# EasyEDA Pro project XORBell.eprj

# Board Main
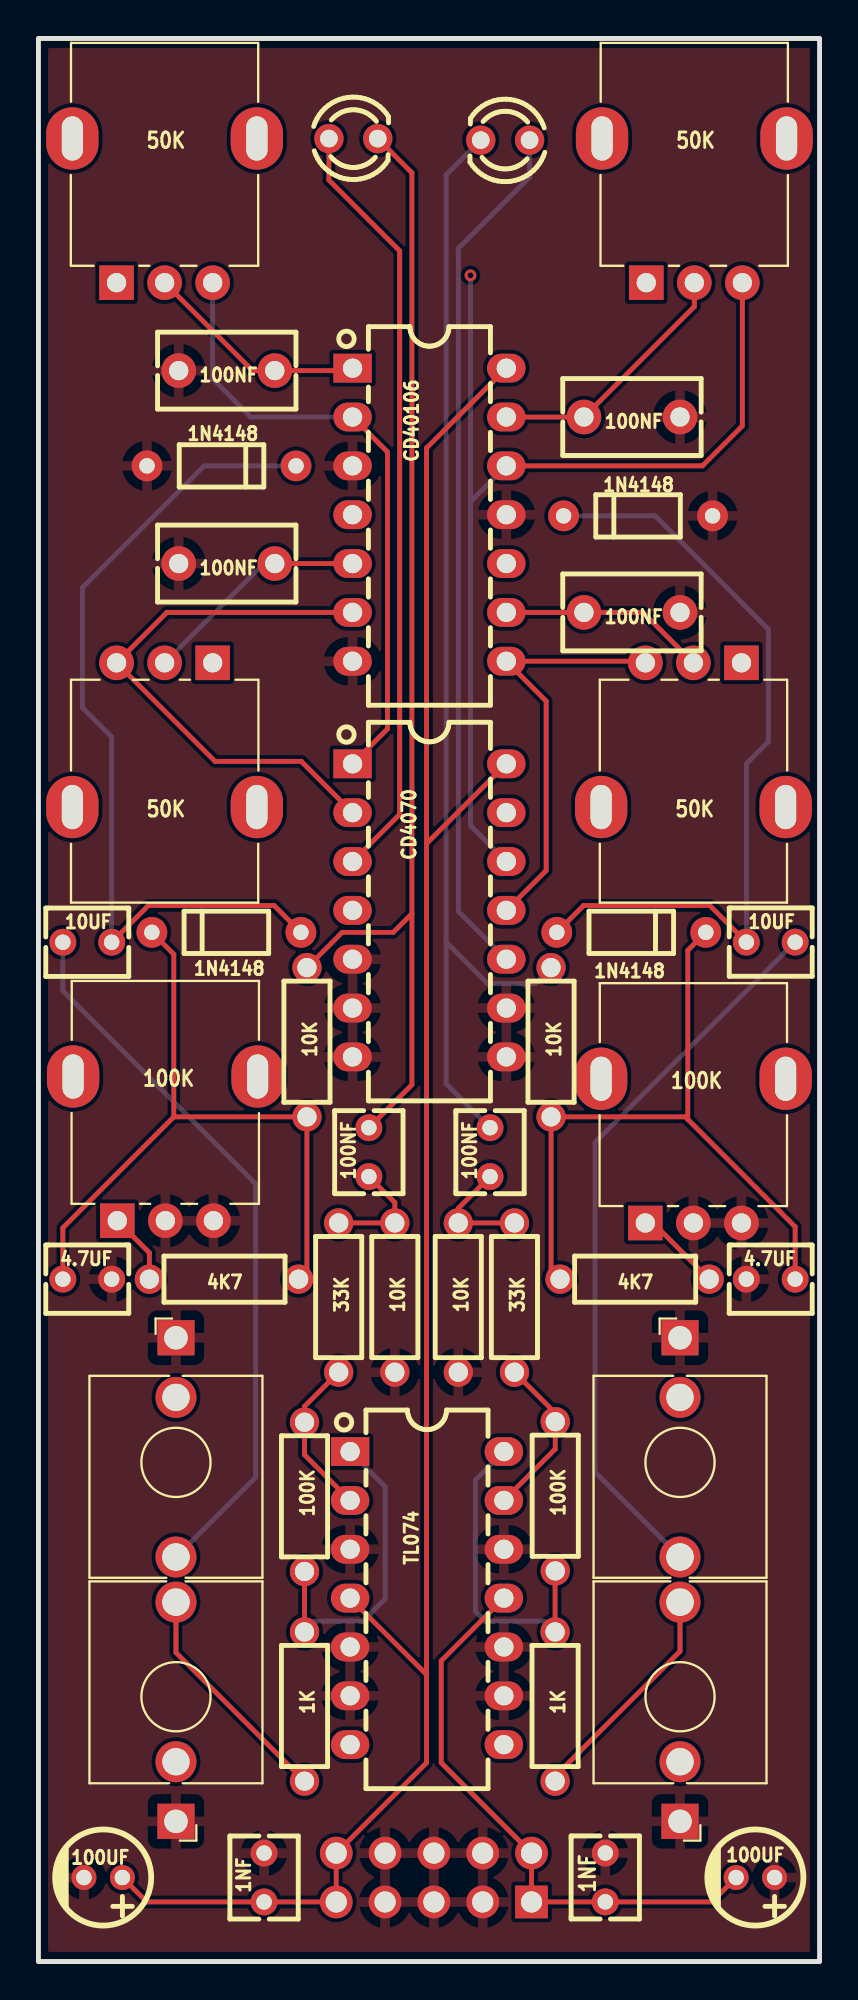
[diagram p0: board, top side]
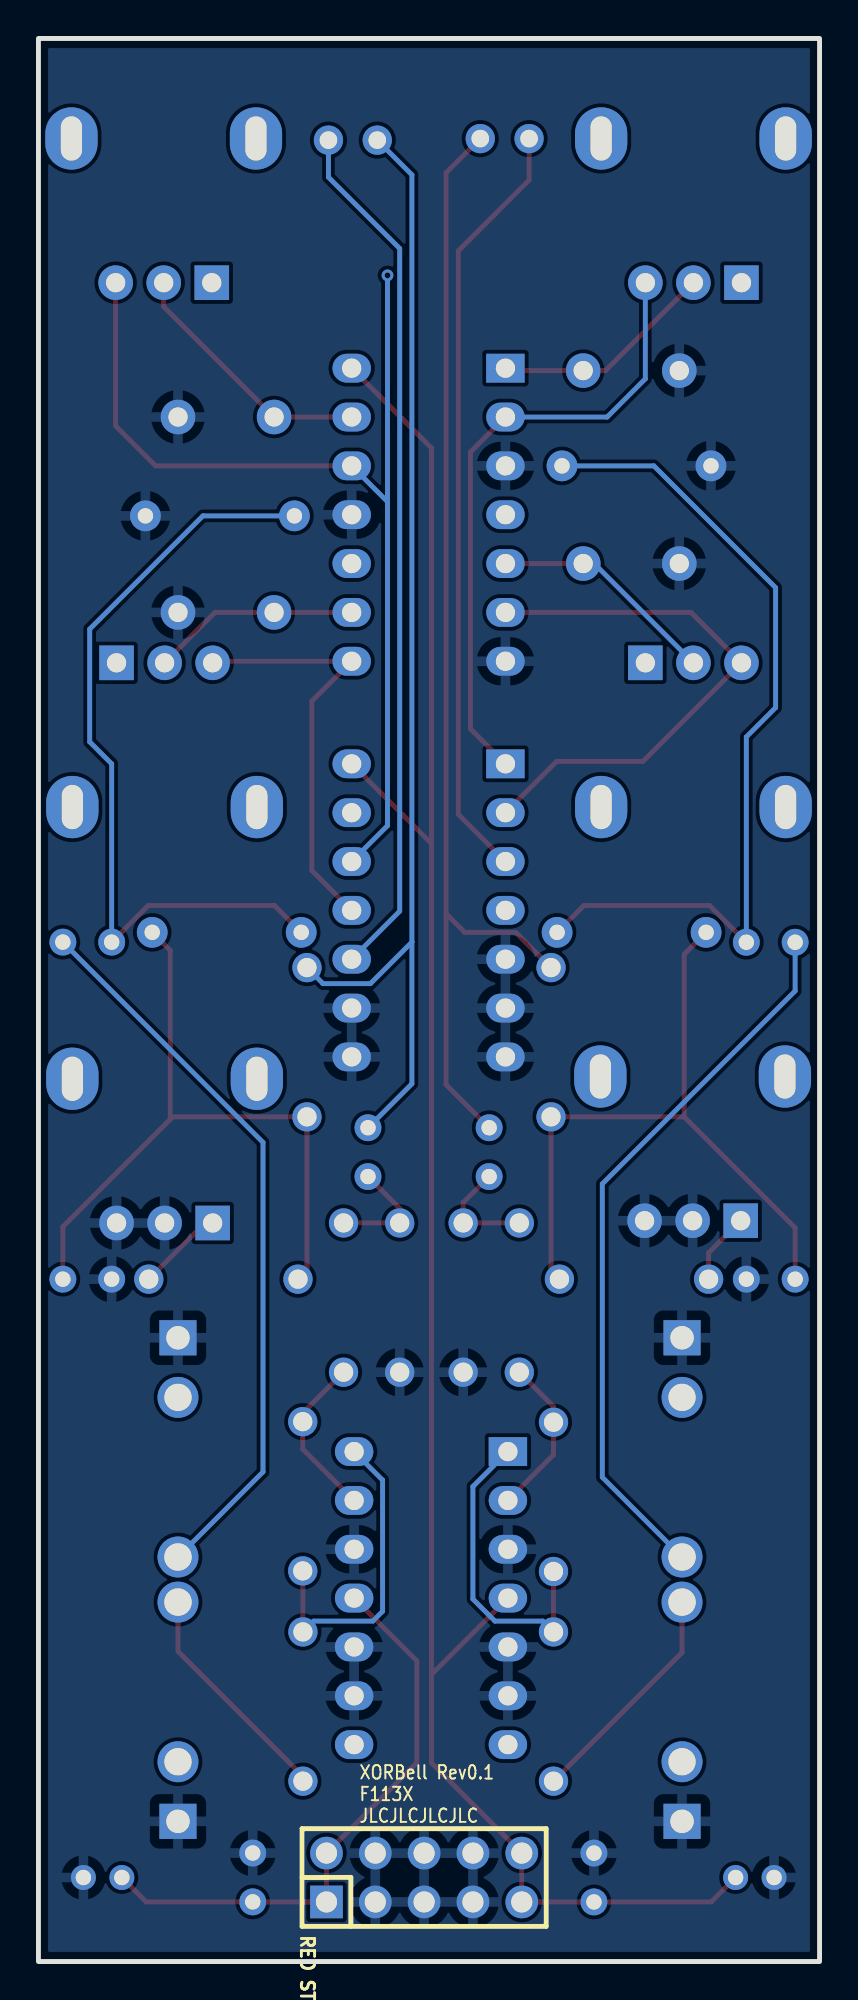
[diagram p1: board, bottom side, seen from below]

Outline 40.64 x 100 mm; copper layers: Top Layer, Bottom Layer. Coordinates in mm from the lower left corner of the outline.
Outline path: rectangle 0,100 40.64,0
Stack: Top Layer 0.035mm / Dielectric1 1.51mm FR4 er 4.5 / Bottom Layer 0.035mm

## Design rules (mm)
template: JLCPCB Capability(Two Layers Board)
spacing copperThickness1oz (default): track to track 0.102, other pairs 0.152 to 0.3
spacing copperThickness2oz: track to track 0.203, other pairs 0.152 to 0.3
track width copperThickness1oz (default): min 0.127, default 0.254, max 2.54
track width copperThickness2oz: min 0.203, default 0.254, max 2.54
differential pair differentialPair (default): width min 0.127, default 0.254, max 2.54; gap min 0.152, default 0.152
via viaSize (default): diameter min 0.5, default 0.61, max 10; hole min 0.3, default 0.305, max 6.3

## Placement (name value [footprint] x y rotation side)
1K  -  [Resistor_Small]  13.84 13.26 90 top
1K#2  -  [Resistor_Small]  26.88 13.26 90 top
1N4148  -  [DO-35_BD2.0-L4.2-P8.20-D0.5-RD]  9.78 53.52 0 top
1N4148#2  -  [DO-35_BD2.0-L4.2-P8.20-D0.5-RD]  9.52 77.77 180 top
1N4148#3  -  [DO-35_BD2.0-L4.2-P8.20-D0.5-RD]  31.2 75.17 0 top
1N4148#4  -  [DO-35_BD2.0-L4.2-P8.20-D0.5-RD]  30.84 53.52 180 top
1NF  100nF  [CAP-TH_L4.2-W3.5-P2.54-D0.5]  11.74 4.37 90 top
4.7UF  -  [CAP-TH_L4.2-W3.5-P2.54-D0.5]  29.49 4.37 90 top
4.7UF#2  -  [CAP-TH_L4.2-W3.5-P2.54-D0.5]  2.54 35.48 0 top
4.7UF#3  -  [CAP-TH_L4.2-W3.5-P2.54-D0.5]  38.1 35.48 0 top
4K7  -  [Resistor_Small]  31.02 35.48 0 top
4K7#2  -  [Resistor_Small]  9.65 35.48 0 top
10K  -  [Resistor_Small]  13.97 47.8 90 top
10K#2  -  [Resistor_Small]  26.67 47.8 90 top
10K#3  -  [Resistor_Small]  18.54 34.52 90 top
10K#4  -  [Resistor_Small]  21.84 34.52 90 top
10UF  -  [CAP-TH_L4.2-W3.5-P2.54-D0.5]  2.54 53 0 top
10UF#2  -  [CAP-TH_L4.2-W3.5-P2.54-D0.5]  38.1 53.01 0 top
33K  -  [Resistor_Small]  15.62 34.52 90 top
33K#2  -  [Resistor_Small]  24.76 34.52 90 top
50K  -  [benjiaomodular:Potentiometer_RV09]  9.06 67.53 270 top
100K  -  [Resistor_Small]  13.84 24.16 90 top
100K#2  -  [Resistor_Small]  26.89 24.19 90 top
100NF  -  [CAP-TH_L4.2-W3.5-P2.54-D0.5]  17.19 42.09 90 top
100NF#2  -  [CAP-TH_L4.2-W3.5-P2.54-D0.5]  23.5 42.09 90 top
100NF#3  -  [CAP-TH_L7.2-W4.0-P5.00-D0.5]  9.8 82.73 0 top
100NF#4  -  [CAP-TH_L7.2-W4.0-P5.00-D0.5]  30.88 80.31 0 top
100NF#5  -  [CAP-TH_L7.2-W4.0-P5.00-D0.5]  9.8 72.69 0 top
100NF#6  -  [CAP-TH_L7.2-W4.0-P5.00-D0.5]  30.88 70.15 0 top
100UF  -  [CAP-TH_BD5.0-P2.00-D0.8-FD]  37.3 4.37 180 top
100UF#2  -  [CAP-TH_BD5.0-P2.00-D0.8-FD]  3.37 4.37 180 top
CD4070  TL074CN  [PDIP-14_L19.7-W6.6-P2.54-LS8.3-BL]  20.34 54.66 270 top
CD40106  TL074CN  [PDIP-14_L19.7-W6.6-P2.54-LS8.3-BL]  20.34 75.23 270 top
FREQ1  -  [benjiaomodular:Potentiometer_RV09]  4.06 87.3 90 top
FREQ2  -  [benjiaomodular:Potentiometer_RV09]  31.62 87.3 90 top
FREQ4  -  [benjiaomodular:Potentiometer_RV09]  36.58 67.53 270 top
FREQ4#2  -  [benjiaomodular:Potentiometer_RV09]  4.1 38.52 90 top
FREQ4#3  -  [benjiaomodular:Potentiometer_RV09]  31.58 38.4 90 top
J1  -  [benjiaomodular:AudioJack_3.5mm]  7.16 32.44 0 top
J1#2  -  [benjiaomodular:AudioJack_3.5mm]  33.38 32.44 0 top
J3  -  [benjiaomodular:AudioJack_3.5mm]  7.16 7.29 180 top
J3#2  -  [benjiaomodular:AudioJack_3.5mm]  33.38 7.29 180 top
LED1  204-10SURD/S530-A3-L  [LED-TH_BD3.0-P2.54-FD]  16.38 94.79 0 top
LED2  204-10SURD/S530-A3-L  [LED-TH_BD3.0-P2.54-FD]  24.28 94.71 180 top
RED STRIP  ZX-PZ2.54-2-5PZZ  [HDR-TH_10P-P2.54-V-M-R2-C5-S2.54]  20.57 4.37 180 bottom
TL074  TL074CN  [PDIP-14_L19.7-W6.6-P2.54-LS8.3-BL]  20.22 18.9 270 top

## Footprints (pads in the part's own frame, mm; a bottom-side part is the same pattern mirrored in y, then rotated)
benjiaomodular:AudioJack_3.5mm
  rect 1.93x1.83 hole 1.22: S(0,0)
  round 2.13 hole 1.43: T(0,-11.4)
  round 2.13 hole 1.42: TN(0,-3.1)
benjiaomodular:Potentiometer_RV09
  rect 1.8x1.8 hole 1: 1(0,0)
  round 1.8 hole 1: 2(0,-2.5) 3(0,-5)
  oval 3.24x2.72 hole 2.3x1.1: 4(7.5,-7.3) 5(7.5,2.3)
CAP-TH_BD5.0-P2.00-D0.8-FD
  round 1.3 hole 0.8: 1(-1,0) 2(1,0)
CAP-TH_L4.2-W3.5-P2.54-D0.5
  round 1.4 hole 0.8: 1(-1.27,0) 2(1.27,0)
CAP-TH_L7.2-W4.0-P5.00-D0.5
  round 1.8 hole 1: 1(-2.499,0) 2(2.499,0)
DO-35_BD2.0-L4.2-P8.20-D0.5-RD
  round 1.6 hole 0.8: 1(-3.876,0) 2(3.876,0)
HDR-TH_10P-P2.54-V-M-R2-C5-S2.54
  rect 1.7x1.7 hole 1.1: 1(-5.08,-1.27)
  round 1.7 hole 1.1: 2(-5.08,1.27) 3(-2.54,-1.27) 4(-2.54,1.27) 5(0,-1.27) 6(0,1.27) 7(2.54,-1.27) 8(2.54,1.27) 9(5.08,-1.27) 10(5.08,1.27)
LED-TH_BD3.0-P2.54-FD
  round 1.524 hole 0.914: 1(-1.27,0) 2(1.27,0)
PDIP-14_L19.7-W6.6-P2.54-LS8.3-BL
  rect 1.5x2 hole 1: 1(-7.62,-4)
  oval 1.5x2 hole 1: 2(-5.08,-4) 3(-2.54,-4) 4(0,-4) 5(2.54,-4) 6(5.08,-4) 7(7.62,-4) 8(7.62,4) 9(5.08,4) 10(2.54,4) 11(0,4) 12(-2.54,4) 13(-5.08,4) 14(-7.62,4)
Resistor_Small
  round 1.524 hole 1: 1(-3.88,0) 2(3.882,0)

## Nets
GND: 1N4148#2.2 1N4148#3.2 1NF.2 4.7UF.2 4.7UF#2.2 4.7UF#3.1 10K#3.1 10K#4.1 100NF#3.1 100NF#4.2 100NF#5.1 100NF#6.2 100UF.1 100UF#2.2 CD4070.5 CD4070.6 CD4070.7 CD4070.8 CD4070.9 CD40106.3 CD40106.7 CD40106.11 FREQ4#2.2 FREQ4#2.3 FREQ4#3.2 FREQ4#3.3 J1.S J1#2.S J3.S J3#2.S RED STRIP.3 RED STRIP.4 RED STRIP.5 RED STRIP.6 RED STRIP.7 RED STRIP.8 TL074.3 TL074.5 TL074.6 TL074.9 TL074.10 TL074.12
+12: 1NF.1 100UF#2.1 CD4070.14 CD40106.14 RED STRIP.9 RED STRIP.10 TL074.4
-12: 4.7UF.1 100UF.2 RED STRIP.1 RED STRIP.2 TL074.11

Pads without a net: 1K 1 2; 1K#2 1 2; 1N4148 1 2; 1N4148#2 1; 1N4148#3 1; 1N4148#4 1 2; 4.7UF#2 1; 4.7UF#3 2; 4K7 1 2; 4K7#2 1 2; 10K 1 2; 10K#2 1 2; 10K#3 2; 10K#4 2; 10UF 1 2; 10UF#2 1 2; 33K 1 2; 33K#2 1 2; 50K 1 2 3 4 5; 100K 1 2; 100K#2 1 2; 100NF 1 2; 100NF#2 1 2; 100NF#3 2; 100NF#4 1; 100NF#5 2; 100NF#6 1; CD4070 1 2 3 4 10 11 12 13; CD40106 1 2 4 5 6 8 9 10 12 13; FREQ1 1 2 3 4 5; FREQ2 1 2 3 4 5; FREQ4 1 2 3 4 5; FREQ4#2 1 4 5; FREQ4#3 1 4 5; J1 T TN; J1#2 T TN; J3 T TN; J3#2 T TN; LED1 1 2; LED2 1 2; TL074 1 2 7 8 13 14

## Via types
v1: diameter 0.61, hole 0.305, Top Layer to Bottom Layer, 1 via

## Routing (per net, layer and track width the routed paths; a pad name or vN(x,y) marks a point on that pad's centre or on a via; arc(x,y) is an arc through that point)
(no net): length 719.1
  Top Layer w0.254: CD4070.3 18.8,59.65 18.8,88.95 15.11,92.63 LED1.1 ; 4K7.1 26.67,35.95 10K#2.1 33.66,43.92 33.78,43.8 ; 1N4148.2 12.26,54.91 5.72,54.91 10UF.2 ; 4.7UF#2.1 1.27,38.15 7.04,43.92 ; 19.43,54.49 18.46,53.52 15.8,53.52 10K.2 ; 19.43,54.49 19.43,45.6 100NF.2 ; 19.43,54.49 19.43,93.01 LED1.2 ; 100K.1 1K.2 ; CD4070.2 13.68,62.41 9.19,62.41 50K.3 6.69,70.15 CD40106.6 ; 26.63,9.38 33.38,16.13 J3#2.T ; 1N4148#4.1 33.78,52.58 33.78,43.8 ; FREQ4#2.1 5.77,36.85 4K7#2.1 ; CD40106.1 16.22,82.73 100NF#3.2 11.14,82.73 FREQ1.2 ; 33.78,43.8 39.37,38.21 4.7UF#3.2 ; 1K.1 7.16,16.07 J3.T ; CD40106.2 18.16,78.5 18.16,64.1 CD4070.1 ; 33K.1 13.84,28.87 100K.2 13.84,26.35 16.22,23.98 ; 7.04,43.92 7.04,52.38 1N4148.1 ; 7.04,43.92 10K.1 13.97,35.92 4K7#2.2 ; 15.62,38.41 18.54,38.41 18.54,39.47 17.19,40.82 ; 1N4148#4.2 28.37,54.91 34.92,54.91 10UF#2.1 ; CD40106.12 34.54,77.77 36.62,79.85 FREQ2.3 ; 4K7.2 31.98,38.4 FREQ4#3.1 ; CD4070.11 26.42,56.73 26.42,65.54 CD40106.8 31.49,67.61 FREQ4.3 ; 100K#2.1 26.88,20.3 1K#2.2 ; 33K#2.1 26.89,28.52 100K#2.2 26.89,26.65 24.22,23.98 ; CD40106.9 31.45,70.15 FREQ4.2 ; 23.5,40.82 21.84,39.17 21.84,38.41 24.76,38.41 ; FREQ2.2 34.12,86.06 28.38,80.31 CD40106.13 ; 100NF#5.2 CD40106.5
  Bottom Layer w0.254: 10K#2.2 25.83,50.85 23.37,50.85 21.21,53.01 ; TL074.14 22.73,25.04 22.73,18.21 23.24,17.7 26.32,17.7 1K#2.2 ; CD4070.12 22.48,59.06 22.48,75.91 ; CD4070.10 21.84,54.62 21.84,89.08 25.55,92.79 LED2.1 ; 21.21,53.01 21.21,92.91 23.01,94.71 ; 21.21,53.01 21.21,45.64 100NF#2.2 ; J1.T 11.3,25.18 11.3,40.44 1.27,50.47 10UF.1 ; 22.48,75.91 v1(22.48,87.68) ; 22.48,75.91 CD40106.12 ; FREQ1.3 9.06,82.3 11.05,80.31 CD40106.2 ; 10UF#2.2 28.96,42.6 28.96,25.46 J1#2.T ; 1N4148#2.1 8.62,77.77 2.29,71.44 2.29,65.2 3.81,63.68 10UF.2 ; 100NF#5.2 11.73,72.69 50K.2 ; 10UF#2.1 36.83,62.28 37.97,63.42 37.97,69.28 32.08,75.17 1N4148#3.1 ; TL074.1 18.03,24.7 18.03,18.85 16.89,17.7 14.41,17.7 1K.2
+12: length 106.6
  Top Layer w0.254: TL074.4 20.19,14.92 ; 20.19,14.92 20.19,58.13 ; 20.19,14.92 20.19,10.34 RED STRIP.10 RED STRIP.9 1NF.1 5.64,3.1 100UF#2.1 ; 20.19,58.13 20.19,78.71 CD40106.14 ; 20.19,58.13 CD4070.14
-12: length 30.3
  Top Layer w0.254: 100UF.2 35.03,3.1 4.7UF.1 29.49,3.1 RED STRIP.1 RED STRIP.2 20.95,10.34 20.95,15.64 TL074.11

## Copper pours and planes (outline as drawn; the poured copper is in the pictures)
GND on Top Layer: 0,100 40.64,100 40.64,0 0,0
GND on Bottom Layer: 0,100 40.64,100 40.64,0 0,0

## Text on the board
Bottom Silkscreen Layer: XORBell Rev0.1 / F113X / JLCJLCJLCJLC
Top Silkscreen Layer: 1NF | 100K | 50K

# Board Panel
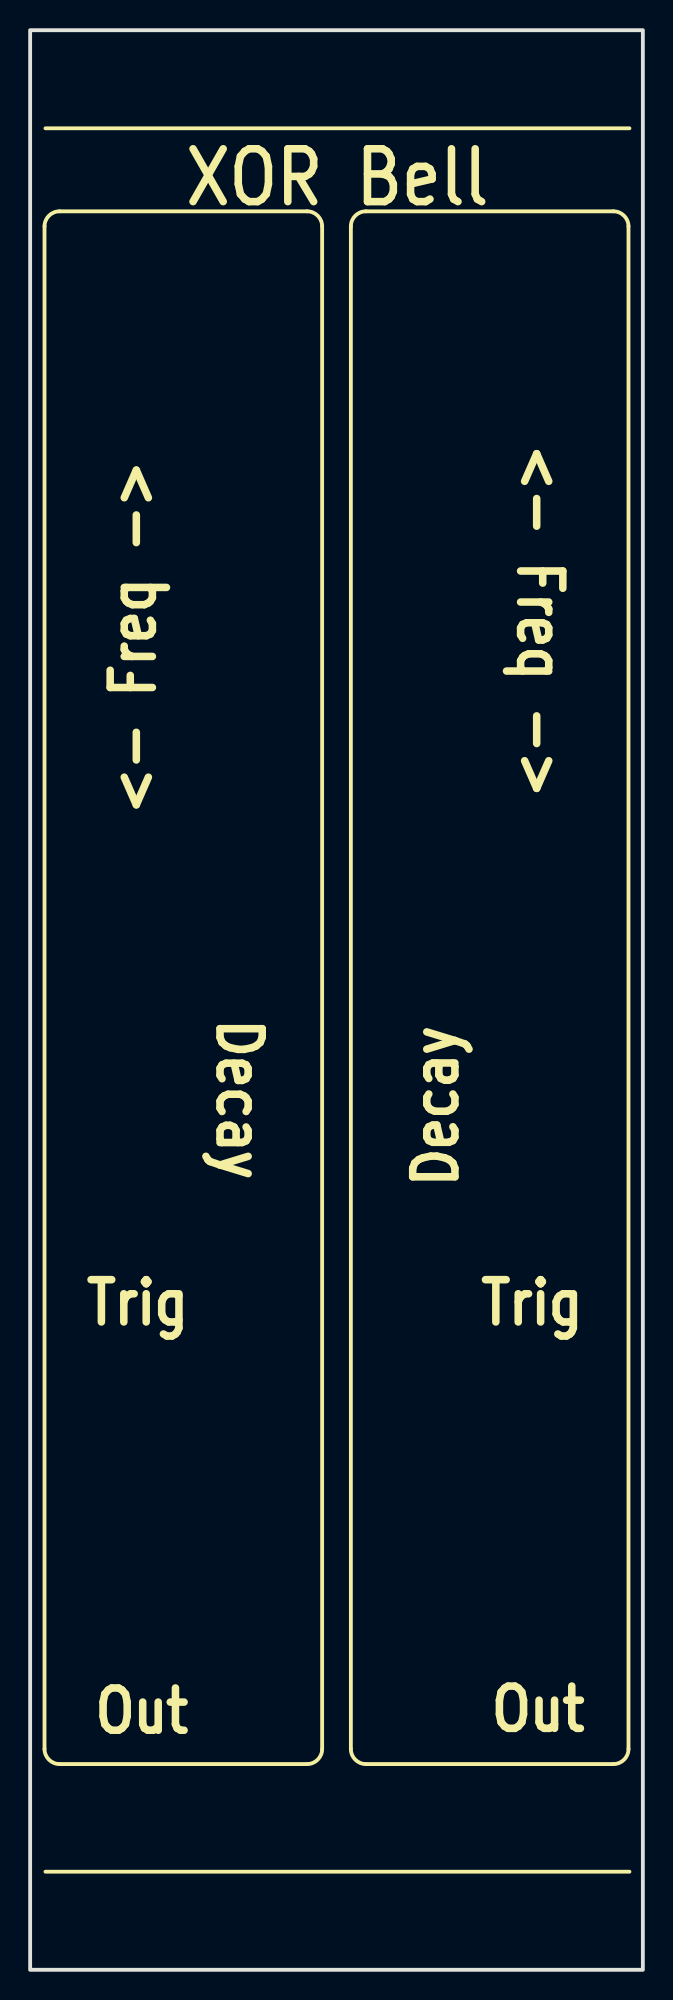
[diagram p2: board, top side]
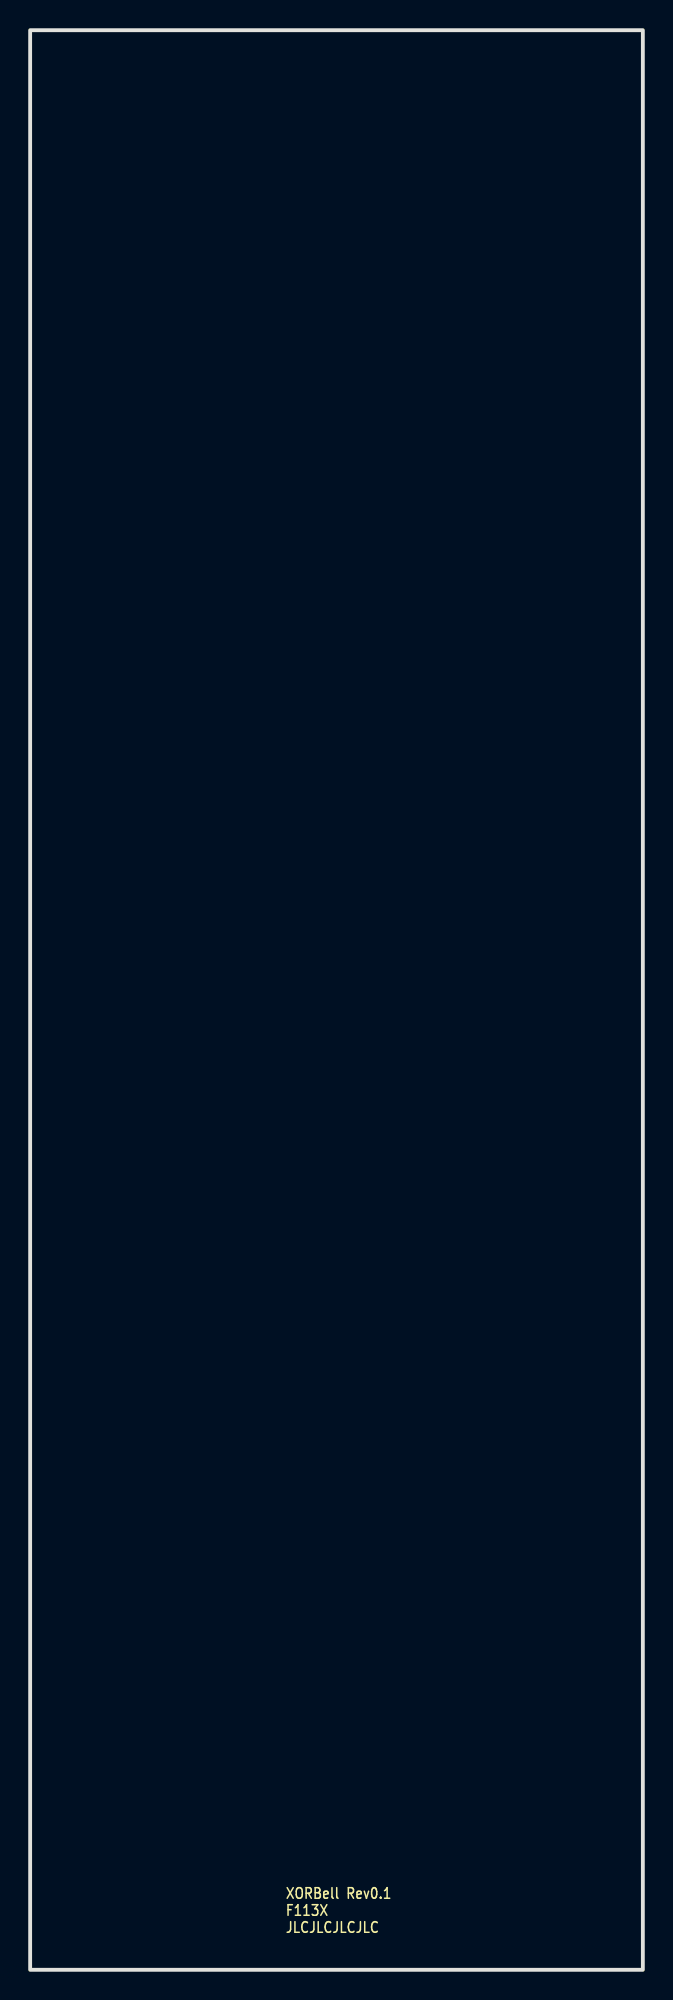
[diagram p3: board, bottom side, seen from below]

Outline 40.64 x 128.5 mm; copper layers: Top Layer, Bottom Layer. Coordinates in mm from the lower left corner of the outline.
Outline path: rectangle 0,128.5 40.64,0
Stack: Top Layer 0.035mm / Dielectric1 1.51mm FR4 er 4.5 / Bottom Layer 0.035mm

## Design rules (mm)
template: JLCPCB Capability(Two Layers Board)
spacing copperThickness1oz (default): track to track 0.102, other pairs 0.152 to 0.3
spacing copperThickness2oz: track to track 0.203, other pairs 0.152 to 0.3
track width copperThickness1oz (default): min 0.127, default 0.254, max 2.54
track width copperThickness2oz: min 0.203, default 0.254, max 2.54
differential pair differentialPair (default): width min 0.127, default 0.254, max 2.54; gap min 0.152, default 0.152
via viaSize (default): diameter min 0.5, default 0.61, max 10; hole min 0.3, default 0.305, max 6.3

## Placement (name value [footprint] x y rotation side)

## Nets

## Text on the board
Bottom Silkscreen Layer: XORBell Rev0.1 / F113X / JLCJLCJLCJLC
Top Silkscreen Layer: <- Freq -> | Decay | Trig | Out | XOR Bell
